# Altium schematic sheet BM83.SchDoc
size 279 x 215 mm; SheetNumber: 1; SheetTotal: 4; SPICEModelCacheLVVEWYVA: <root> / <DocumentId>LVVEWYVA</DocumentId> / <CacheFrame Number="0"> / <Model Name="cap" Kind="MDL"> / <Text>*Default semiconductor capacitor / .MODEL CAP C()</Text> / </Model> / </CacheFrame> / </root>
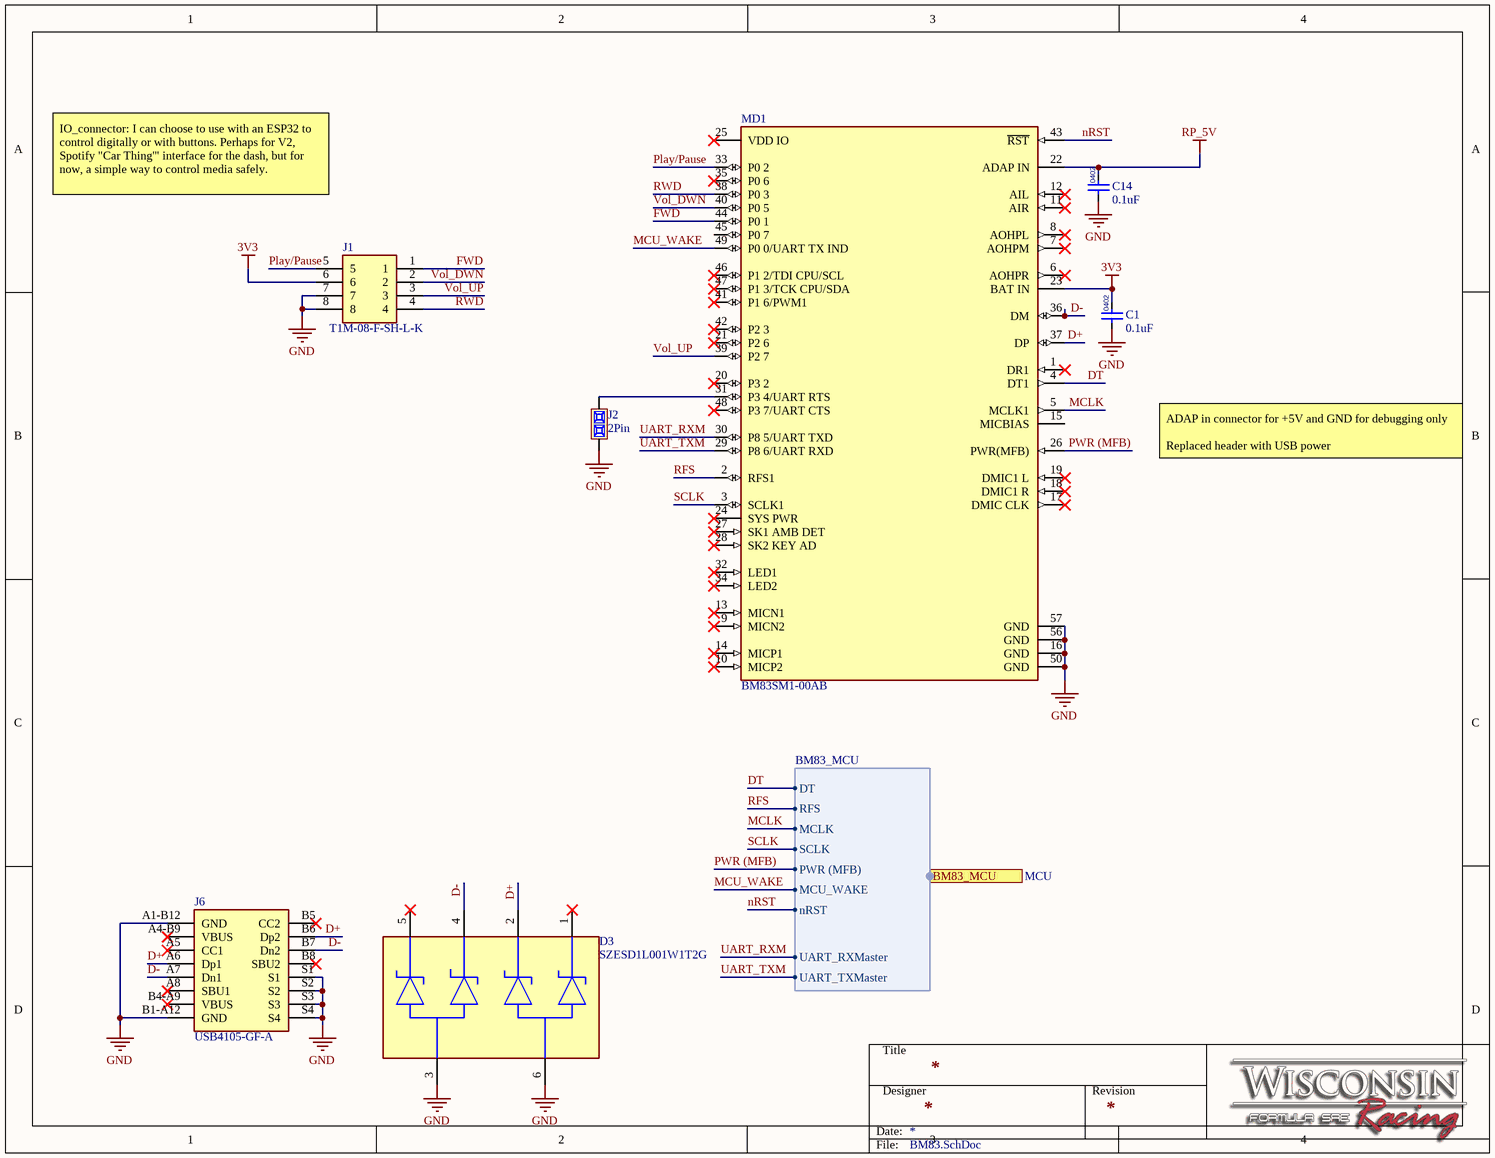
[diagram p0: BM83.SchDoc]

## Parts
C1  0.1uF  [FP-CC0402-IPC_B]
C14  0.1uF  [FP-CC0402-IPC_B]
D3  SZESD1L001W1T2G  [FP-419B-02-MFG]
J1  T1M-08-F-SH-L-K  [T1M-08-F-SH-L-K]
J2  2Pin  [2 Pin Male]
J6  USB4105-GF-A  [USB4105-GF-A]
MD1  BM83SM1-00AB  [FP-BM83SM1-00AB-MFG]

## Ports
BM83_MCU (harness BM83_MCU, see MCU)

## Harnesses
BM83_MCU: MCLK, MCU_WAKE, SCLK, PWR (MFB), RFS, DT, nRST, UART_TXMaster, UART_RXMaster

## Nets
3V3: C1.2 J1.6 MD1.23(BAT_IN)
GND: C1.1 C14.1 D3.3(GND) D3.6(GND) J1.7 J1.8 J2.1 J6.A1-B12(GND) J6.B1-A12(GND) J6.S1 J6.S2 J6.S3 J6.S4 MD1.16(GND) MD1.50(GND) MD1.56(GND) MD1.57(GND)
RP_5V: C14.2 MD1.22(ADAP_IN)
D+: D3.2(2_CATHODE) J6.A6(Dp1) J6.B6(Dp2) MD1.37(DP)
D-: D3.4(3_CATHODE) J6.A7(Dn1) J6.B7(Dn2) MD1.36(DM)
DT: MD1.4(DT1) ; port BM83_MCU.DT
FWD: J1.1 MD1.44(P0_1)
MCLK: MD1.5(MCLK1) ; port BM83_MCU.MCLK
MCU_WAKE: MD1.49(P0_0/UART_TX_IND) ; port BM83_MCU.MCU_WAKE
nRST: MD1.43(~{RST}) ; port BM83_MCU.nRST
Play/Pause: J1.5 MD1.33(P0_2)
PWR (MFB): MD1.26(PWR(MFB)) ; port BM83_MCU.PWR (MFB)
RFS: MD1.2(RFS1) ; port BM83_MCU.RFS
RWD: J1.4 MD1.38(P0_3)
SCLK: MD1.3(SCLK1) ; port BM83_MCU.SCLK
UART_RXM: MD1.30(P8_5/UART_TXD) ; port BM83_MCU.UART_RXMaster
UART_TXM: MD1.29(P8_6/UART_RXD) ; port BM83_MCU.UART_TXMaster
Vol_DWN: J1.2 MD1.40(P0_5)
Vol_UP: J1.3 MD1.39(P2_7)
NetJ2_2: J2.2 MD1.31(P3_4/UART_RTS)

Not connected (* = marked no-connect by the designer): D3 1(1_CATHODE)* 5(4_CATHODE)*; J6 A4-B9(VBUS)* A5(CC1)* A8(SBU1)* B4-A9(VBUS)* B5(CC2)* B8(SBU2)*; MD1 1(DR1)* 6(AOHPR)* 7(AOHPM)* 8(AOHPL)* 9(MICN2)* 10(MICP2)* 11(AIR)* 12(AIL)* 13(MICN1)* 14(MICP1)* 15(MICBIAS) 17(DMIC_CLK)* 18(DMIC1_R)* 19(DMIC1_L)* 20(P3_2)* 21(P2_6)* 24(SYS_PWR)* 25(VDD_IO)* 27(SK1_AMB_DET)* 28(SK2_KEY_AD)* 32(LED1)* 34(LED2)* 35(P0_6)* 41(P1_6/PWM1)* 42(P2_3)* 45(P0_7) 46(P1_2/TDI_CPU/SCL)* 47(P1_3/TCK_CPU/SDA)* 48(P3_7/UART_CTS)*

## Notes on the sheet
- IO_connector: I can choose to use with an ESP32 to control digitally or with buttons. Perhaps for V2, Spotify "Car Thing'" interface for the dash, but for now, a simple way to control media safely.
- ADAP in connector for +5V and GND for debugging only
  Replaced header with USB power
- Title
- Designer
- Revision
- Date:
- File:
- (in symbol CMP-Cap-00006-1) 0402

## Library data of the parts
C1 C14 = CMP-Cap-00006-1: Ceramic Capacitor, Multilayer, Ceramic, 16V, 10% +Tol, 10% -Tol, X7R, 15% TC, 0.1uF, Surface Mount, 0402; Dielectric: XR7; Capacitance: 100nF; Tolerance: 10%; Voltage Rating: 16V
D3 = CMP-00278-82193701-1: SZESD1L001W1T2G ESD Protection Diode for High Speed Data Line Low Capacitance 4-Channel 6-Pin SC-88 T/R; Manufacturer Lifecycle Status: ACTIVE; Peak Pulse Current: 30A; Reverse Standoff Voltage: 5V; Direction: Unidirectional; Number of Channels: 4; Max Junction Temperature (Tj): 125°C; Breakdown Voltage: 16.5V; Capacitance: 200fF; RoHS: Compliant; Min Operating Temperature: -55°C; NexarPartId: 82193701; Packaging: Cut Tape; Max Operating Temperature: 125°C; Lifecycle Status: Production; Height: 1.1mm
J1 = T1M-08-F-SH-L-K: Connector; Manufacturer_Name: SAMTEC; Datasheet Link: https://suddendocs.samtec.com/prints/t1m-xx-x-sh-l-x-xx-mkt.pdf?_gl=1*uq43fd*_gcl_au*ODYxNDQ2NDA1LjE3NjEzMDczOTg.*_ga*MTA1NTI3NDYyNy4xNjk0MTg3NDQy*_ga_3KFNZC07WW*czE3NjEzMDczOTckbzEzOCRnMSR0MTc2MTMwNzkyNyRqNTUkbDAkaDA.; Height: 4.6mm; Manufacturer_Part_Number: T1M-08-F-SH-L-K; Mouser Part Number: 200-T1M08FSHLK; Mouser Price/Stock: https://www.mouser.co.uk/ProductDetail/Samtec/T1M-08-F-SH-L-K?qs=PB6%2FjmICvI34CkCBlJWkQg%3D%3D
J2 = CMP-007-000048-3: Board Connector, 2 Contact(s), 1 Row(s), Male, Straight, 0.1 inch Pitch, Solder Terminal, Black Insulator, Receptacle; MIL Conformance: No; Contact Pattern: RECTANGULAR; Body Breadth: 0.092inch; Dielectric Withstanding Voltage (AC): 750V; Plating Thickness: 100uin; Reliability: COMMERCIAL; Option: General Purpose; Body Depth: 0.09inch; Number of Contacts: 2; Reference Standard: UL; Number Of PCB Rows: 1; Contact Style: SQ PIN-SKT; Mating Information: MULTIPLE MATING PARTS AVAILABLE; Body Length: 0.184inch; Rated Current (Signal): 3A; Insulation Resistance: 5GR; Min Operating Temperature: -65°C; Termination: Solder; Source: Components - 16.09.22 - 20.27.SchLib; RoHS Compliant: No; Filter Feature: No; Insulation Color: Black; Contact Finish - Mating: NOT SPECIFIED; Connector Type: BOARD CONNECTOR; Contact Material: Bronze; Design Item ID: CMP-002-00006-7; Flammability Rating: UL94 V-0; JESD-609 Code: e0; REACH SVHC: No SVHC; Max Operating Temperature: 105°C; Insulation Material: Thermoplastic; Mixed Contacts: No; Number Of Connectors: 1; Number of Rows Loaded: 1; Mount: Board; Body/Shell Style: RECEPTACLE; IEC Conformance: No; Terminal Pitch: 2.54mm; Mating Contact Pitch: 0.1inch; Terminal Length: 0.12inch; Contact Gender: Male; Contact Finish - Termination: TIN LEAD OVER NICKEL; Mounting Style: STRAIGHT; DIN Conformance: No; PCB Contact Pattern: RECTANGULAR
J6 = CMP-007-000084-3: Conn USB 2.0 Type C RCP 24 POS 0.3mm/0.5mm Solder RA SMD 24 Terminal 1 Port T/R
MD1 = CMP-06331-000058-1: BLUETOOTH AUDIO MODULE